# Altium schematic sheet input_matrix.SchDoc
size A; SheetNumber: 2; SheetTotal: 5
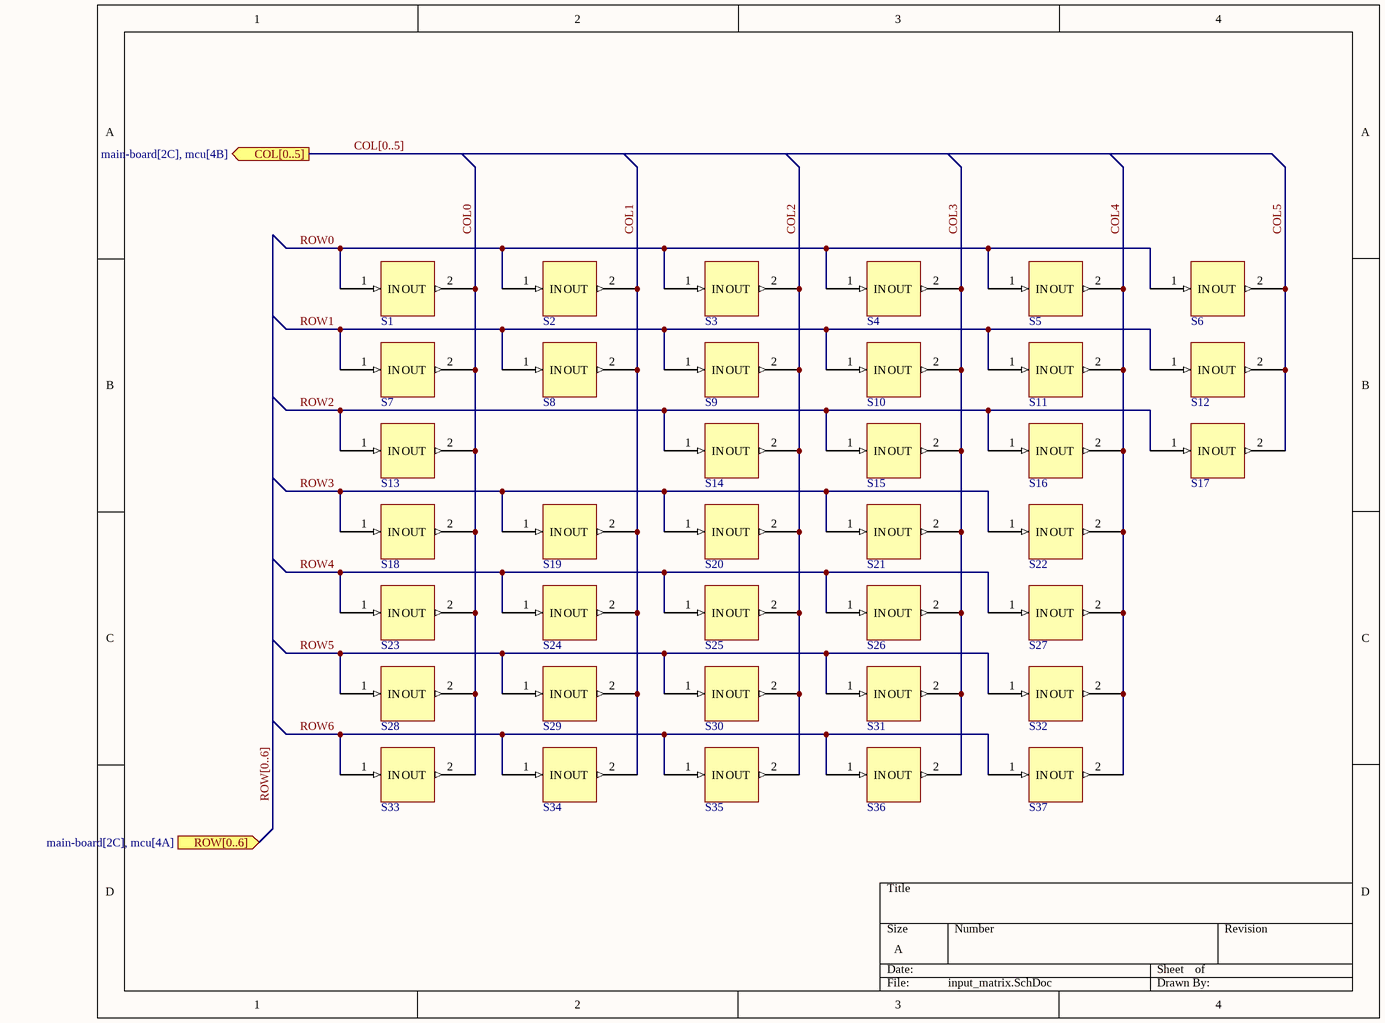
[diagram p0: input_matrix.SchDoc]

## Parts
S1  temp_switch  [PCBComponent_1]  (value not drawn)
S2  temp_switch  [PCBComponent_1]  (value not drawn)
S3  temp_switch  [PCBComponent_1]  (value not drawn)
S4  temp_switch  [PCBComponent_1]  (value not drawn)
S5  temp_switch  [PCBComponent_1]  (value not drawn)
S6  temp_switch  [PCBComponent_1]  (value not drawn)
S7  temp_switch  [PCBComponent_1]  (value not drawn)
S8  temp_switch  [PCBComponent_1]  (value not drawn)
S9  temp_switch  [PCBComponent_1]  (value not drawn)
S10  temp_switch  [PCBComponent_1]  (value not drawn)
S11  temp_switch  [PCBComponent_1]  (value not drawn)
S12  temp_switch  [PCBComponent_1]  (value not drawn)
S13  temp_switch  [PCBComponent_1]  (value not drawn)
S14  temp_switch  [PCBComponent_1]  (value not drawn)
S15  temp_switch  [PCBComponent_1]  (value not drawn)
S16  temp_switch  [PCBComponent_1]  (value not drawn)
S17  temp_switch  [PCBComponent_1]  (value not drawn)
S18  temp_switch  [PCBComponent_1]  (value not drawn)
S19  temp_switch  [PCBComponent_1]  (value not drawn)
S20  temp_switch  [PCBComponent_1]  (value not drawn)
S21  temp_switch  [PCBComponent_1]  (value not drawn)
S22  temp_switch  [PCBComponent_1]  (value not drawn)
S23  temp_switch  [PCBComponent_1]  (value not drawn)
S24  temp_switch  [PCBComponent_1]  (value not drawn)
S25  temp_switch  [PCBComponent_1]  (value not drawn)
S26  temp_switch  [PCBComponent_1]  (value not drawn)
S27  temp_switch  [PCBComponent_1]  (value not drawn)
S28  temp_switch  [PCBComponent_1]  (value not drawn)
S29  temp_switch  [PCBComponent_1]  (value not drawn)
S30  temp_switch  [PCBComponent_1]  (value not drawn)
S31  temp_switch  [PCBComponent_1]  (value not drawn)
S32  temp_switch  [PCBComponent_1]  (value not drawn)
S33  temp_switch  [PCBComponent_1]  (value not drawn)
S34  temp_switch  [PCBComponent_1]  (value not drawn)
S35  temp_switch  [PCBComponent_1]  (value not drawn)
S36  temp_switch  [PCBComponent_1]  (value not drawn)
S37  temp_switch  [PCBComponent_1]  (value not drawn)

## Ports
COL[0..5] (out, see main-board[2C], mcu[4B]), ROW[0..6] (in, see main-board[2C], mcu[4A])

## Nets
COL0: S1.2(OUT) S7.2(OUT) S13.2(OUT) S18.2(OUT) S23.2(OUT) S28.2(OUT) S33.2(OUT)
COL1: S2.2(OUT) S8.2(OUT) S19.2(OUT) S24.2(OUT) S29.2(OUT) S34.2(OUT)
COL2: S3.2(OUT) S9.2(OUT) S14.2(OUT) S20.2(OUT) S25.2(OUT) S30.2(OUT) S35.2(OUT)
COL3: S4.2(OUT) S10.2(OUT) S15.2(OUT) S21.2(OUT) S26.2(OUT) S31.2(OUT) S36.2(OUT)
COL4: S5.2(OUT) S11.2(OUT) S16.2(OUT) S22.2(OUT) S27.2(OUT) S32.2(OUT) S37.2(OUT)
COL5: S6.2(OUT) S12.2(OUT) S17.2(OUT)
ROW0: S1.1(IN) S2.1(IN) S3.1(IN) S4.1(IN) S5.1(IN) S6.1(IN)
ROW1: S7.1(IN) S8.1(IN) S9.1(IN) S10.1(IN) S11.1(IN) S12.1(IN)
ROW2: S13.1(IN) S14.1(IN) S15.1(IN) S16.1(IN) S17.1(IN)
ROW3: S18.1(IN) S19.1(IN) S20.1(IN) S21.1(IN) S22.1(IN)
ROW4: S23.1(IN) S24.1(IN) S25.1(IN) S26.1(IN) S27.1(IN)
ROW5: S28.1(IN) S29.1(IN) S30.1(IN) S31.1(IN) S32.1(IN)
ROW6: S33.1(IN) S34.1(IN) S35.1(IN) S36.1(IN) S37.1(IN)

## Buses and harness runs
bus COL[0..5] = port COL[0..5]
bus ROW[0..6] = port ROW[0..6]